# EAGLE design SparkFun GPS RTK Surveyor - Single End (EAGLE 9.6.2)

## Sheet 1 of 2
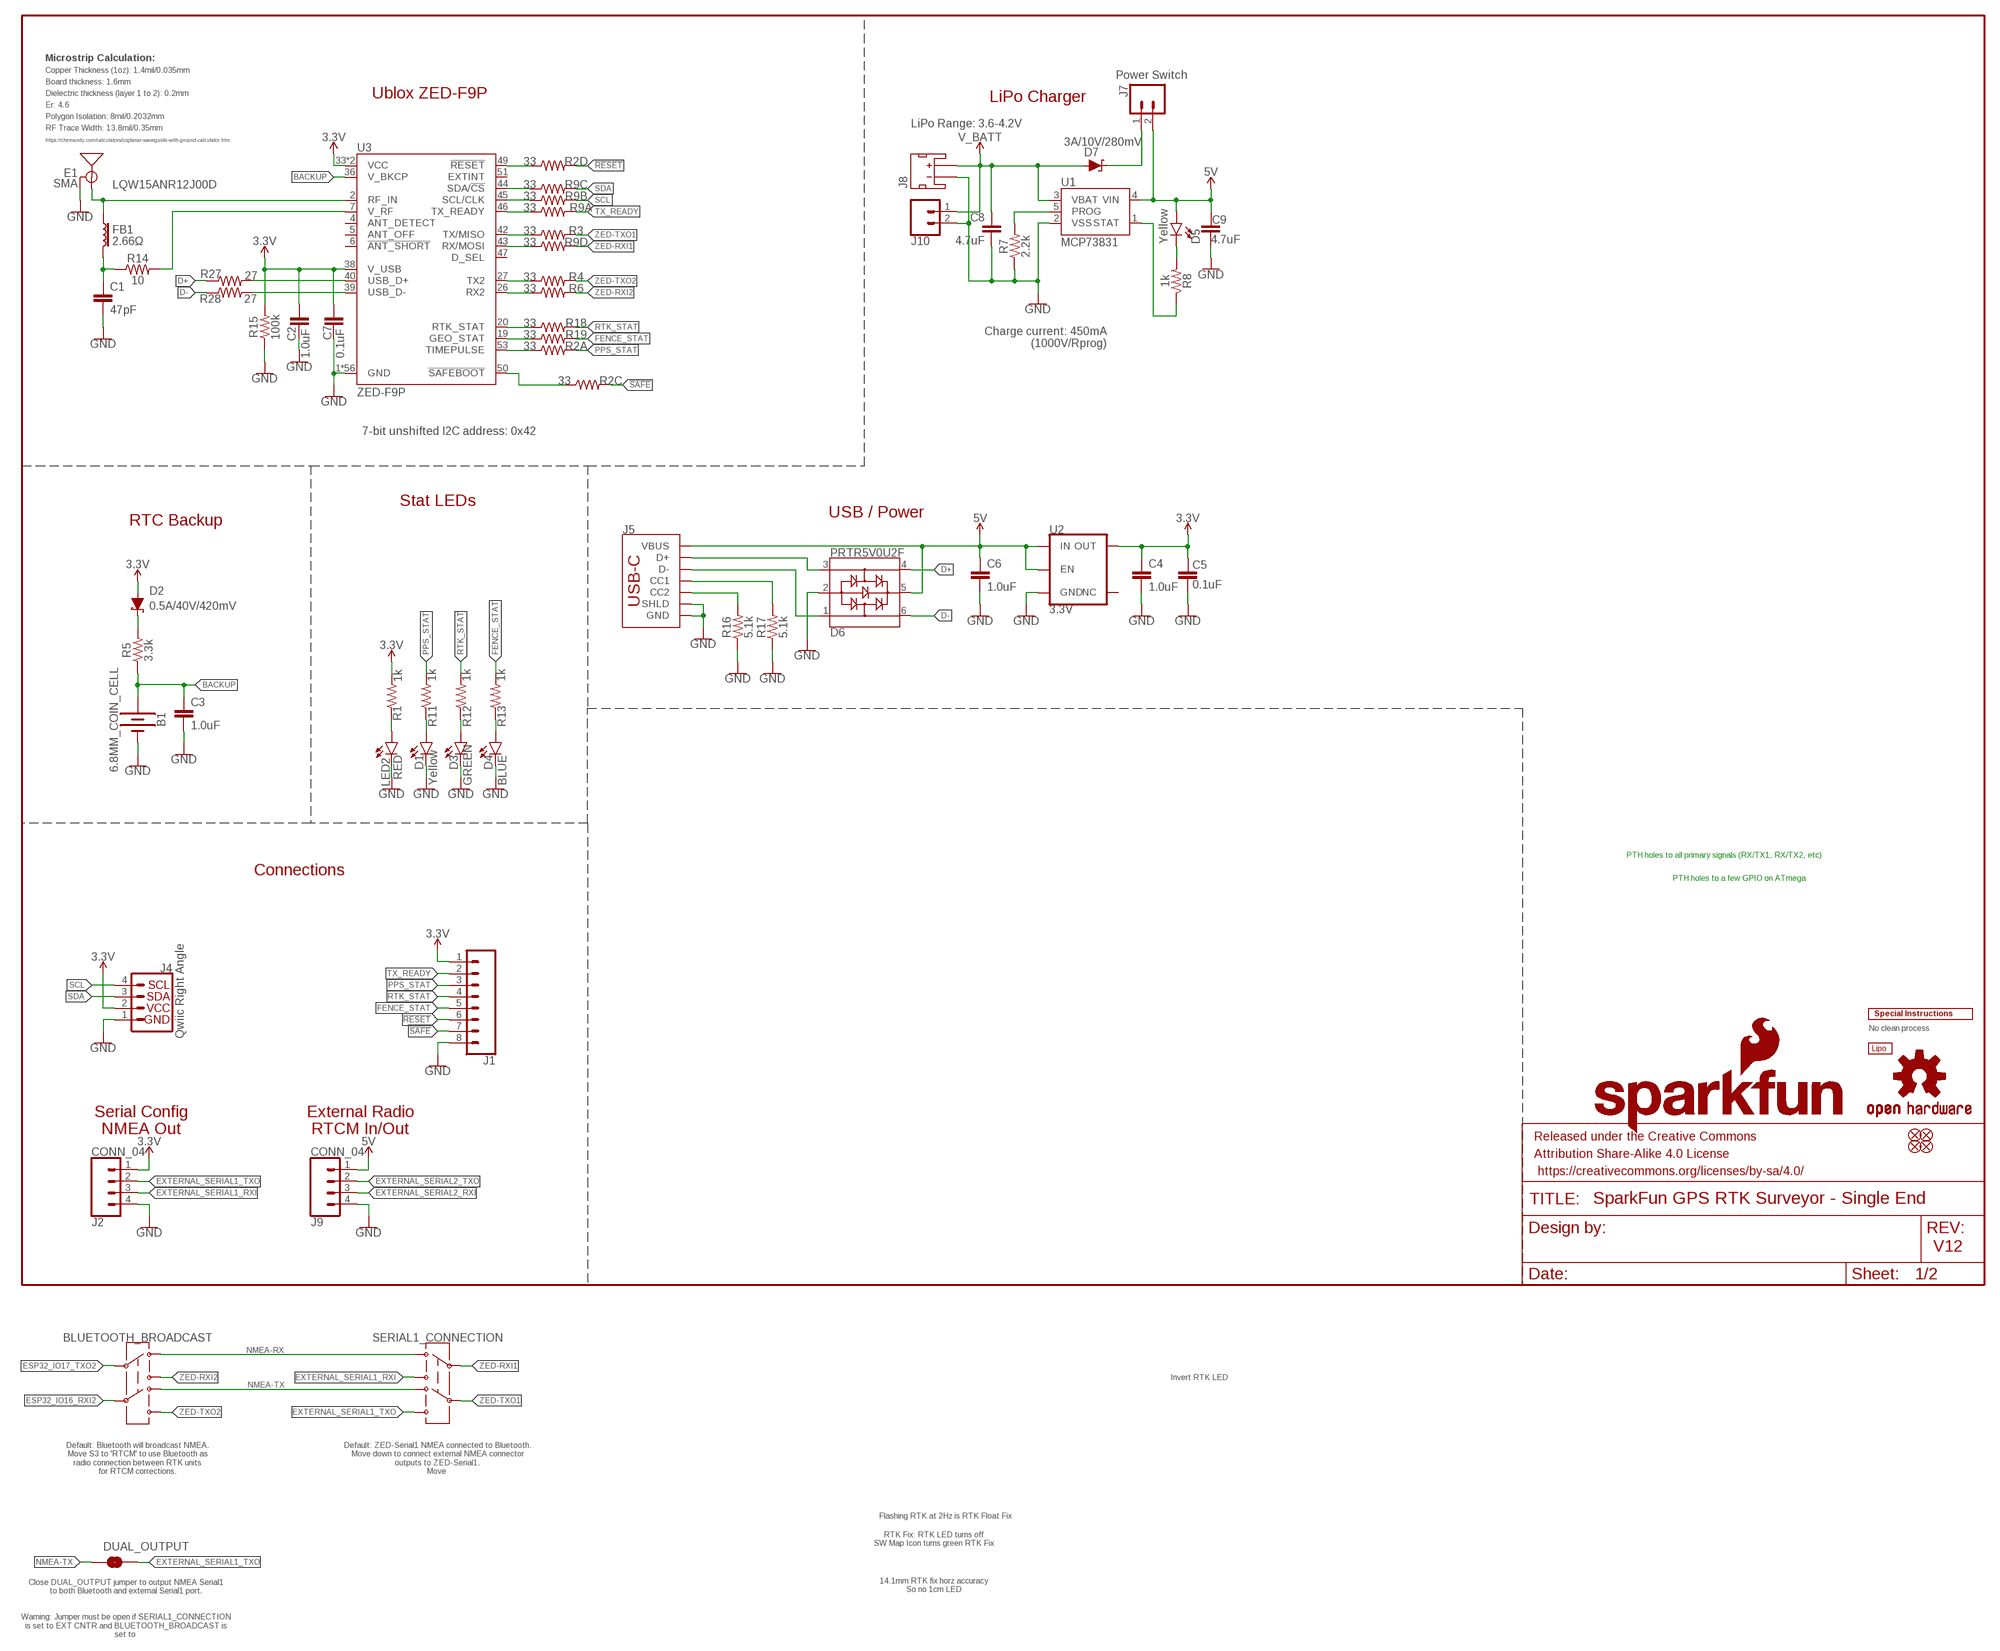
[diagram p0: schematic, sheet 1, part 1 of 2]
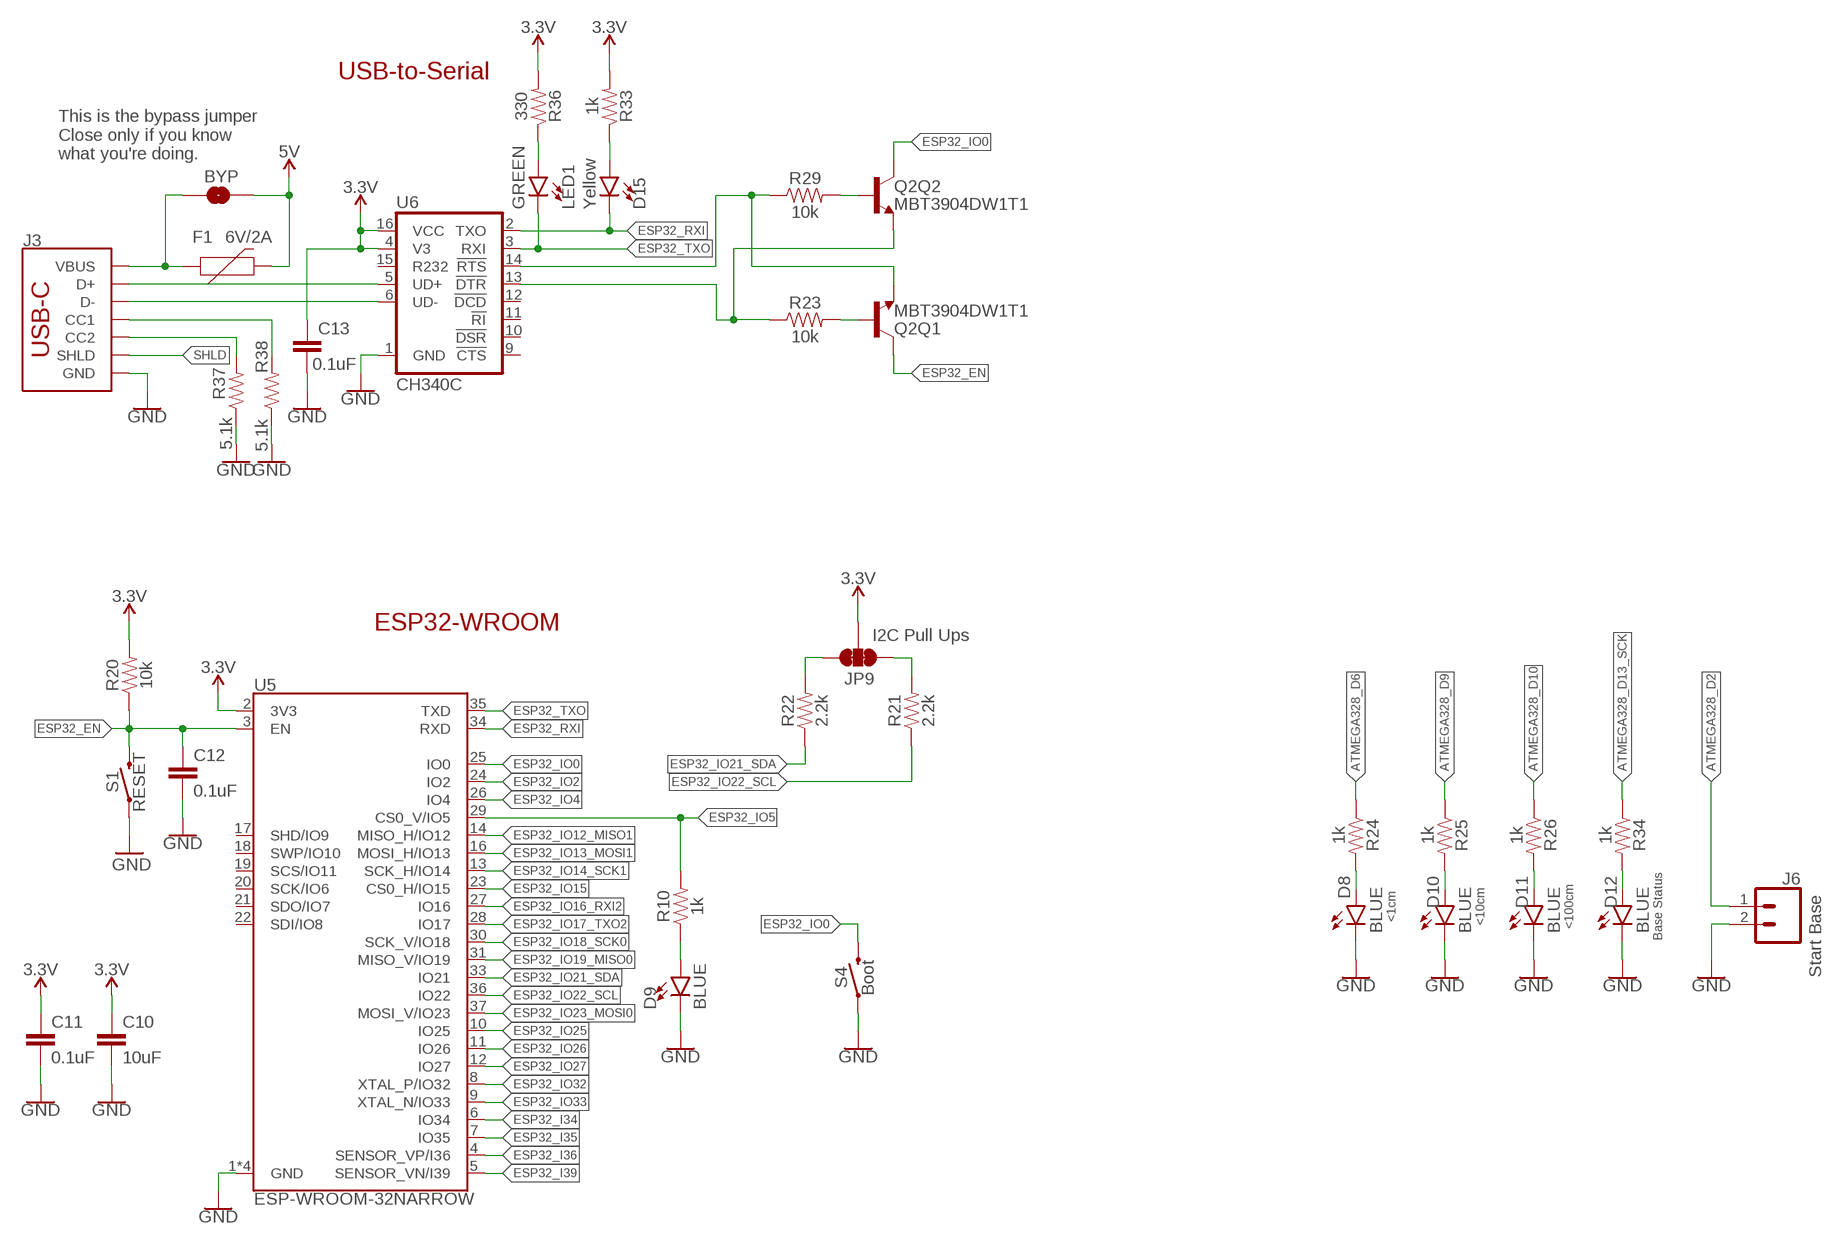
[diagram p1: schematic, sheet 1, part 2 of 2]

### Parts
B1  6.8MM_COIN_CELL  ML414H_IV01E_BATTERY  [ML414H_IV01E]
BLUETOOTH_BROADCAST  SWITCH-DPDT-SMD-AYZ0202  [SWITCH_DPDT_SMD_AYZ0202]
BT1  LIPO-OUTLINE1100  [LIPO-1000]
BYP  JUMPER-SMT_2_NO_SILK  [SMT-JUMPER_2_NO_SILK]
C1  47pF  47PF-0402-25V-5%-X7R  [0402]
C2  1.0uF  1.0UF-0603-16V-10%-X7R  [0603]
C3  1.0uF  1.0UF-0603-16V-10%-X7R  [0603]
C4  1.0uF  1.0UF-0603-16V-10%-X7R  [0603]
C5  0.1uF  0.1UF-0603-25V-5%  [0603]
C6  1.0uF  1.0UF-0603-16V-10%-X7R  [0603]
C7  0.1uF  0.1UF-0603-25V-5%  [0603]
C8  4.7uF  4.7UF-0603-35V-(20%)  [0603]
C9  4.7uF  4.7UF-0603-35V-(20%)  [0603]
C10  10uF  10UF-0603-6.3V-20%  [0603]
C11  0.1uF  0.1UF-0603-25V-(+80/-20%)  [0603]
C12  0.1uF  0.1UF-0603-25V-(+80/-20%)  [0603]
C13  0.1uF  0.1UF-0603-25V-(+80/-20%)  [0603]
D1  Yellow  LED-YELLOW0603  [LED-0603]
D2  0.5A/40V/420mV  DIODE-SCHOTTKY-PMEG4005EJ  [SOD-323]
D3  GREEN  LED-GREEN0603  [LED-0603]
D4  BLUE  LED-BLUE0603  [LED-0603]
D5  Yellow  LED-YELLOW0603  [LED-0603]
D6  PRTR5V0U2F  [SOT886]
D7  3A/10V/280mV  DIODE-SCHOTTKY-BAT60A  [SOD-323]
D8  BLUE  LED-BLUE0603  [LED-0603]
D9  BLUE  LED-BLUE0603  [LED-0603]
D10  BLUE  LED-BLUE0603  [LED-0603]
D11  BLUE  LED-BLUE0603  [LED-0603]
D12  BLUE  LED-BLUE0603  [LED-0603]
D15  Yellow  LED-YELLOW0603  [LED-0603]
DUAL_OUTPUT  JUMPER-SMT_2_NO_SILK  [SMT-JUMPER_2_NO_SILK]
E1  SMA  ANTENNA-GROUNDEDEDGE_SMA_SMD  [SMA-EDGE-SMD]
F1  6V/2A  PPTC_6V2A  [1210]
FB1  2.66Ω  FERRITE_BEAD-0402-2.66OHM-1GHZ  [0402-TIGHT]
FRAME2  FRAME-LEDGER  [CREATIVE_COMMONS]
J1  CONN_08NO_SILK_DNP  [1X08_NO_SILK]
J2  CONN_04  [JST-4-SMD-1.25MM-LOCKING]
J3  USB-C  USB_C_2-LAYER_PADS  [USB-C-16P-2LAYER-PADS]
J4  Qwiic Right Angle  I2C_STANDARDQWIIC  [JST04_1MM_RA]
J5  USB_C_2-LAYER_PADS  [USB-C-16P-2LAYER-PADS]
J6  Start Base  CONN_02-JST-2MM-SMT  [JST-2-SMD]
J7  Power Switch  CONN_02-JST-2MM-SMT  [JST-2-SMD]
J8  JST_2MM_MALE  [JST-2-SMD]
J9  CONN_04  [JST-4-SMD-1.25MM-LOCKING]
J10  CONN_021X02_NO_SILK  [1X02_NO_SILK]
JP9  JUMPER-SMT_3_2-NC_TRACE_SILK  [SMT-JUMPER_3_2-NC_TRACE_SILK]
JP21  FIDUCIALUFIDUCIAL  [MICRO-FIDUCIAL]
JP61  FIDUCIALUFIDUCIAL  [MICRO-FIDUCIAL]
JP71  FIDUCIALUFIDUCIAL  [MICRO-FIDUCIAL]
JP81  FIDUCIALUFIDUCIAL  [MICRO-FIDUCIAL]
LED1  GREEN  LED-GREEN0603  [LED-0603]
LED2  RED  LED-RED0603  [LED-0603]
LOGO1  OSHW-LOGOMINI  [OSHW-LOGO-MINI]
LOGO2  SFE_LOGO_NAME_FLAME.1_INCH  [SFE_LOGO_NAME_FLAME_.1]
Q2  MBT3904DW1T1  TRANS_NPN_DUAL-MBT3904DW1T1  [SC70-6]
R1  1k  1KOHM-0603-1/10W-1%  [0603]
R2  33  33OHM_RA-1206-1/16W-5%  [1206_RA]
R3  33  33OHM-0603-1/10W-1%  [0603]
R4  33  33OHM-0603-1/10W-1%  [0603]
R5  3.3k  3.3KOHM-0603-1/10W-1%  [0603]
R6  33  33OHM-0603-1/10W-1%  [0603]
R7  2.2k  2.2KOHM-0603-1/10W-1%  [0603]
R8  1k  1KOHM-0603-1/10W-1%  [0603]
R9  33  33OHM_RA-1206-1/16W-5%  [1206_RA]
R10  1k  1KOHM-0603-1/10W-1%  [0603]
R11  1k  1KOHM-0603-1/10W-1%  [0603]
R12  1k  1KOHM-0603-1/10W-1%  [0603]
R13  1k  1KOHM-0603-1/10W-1%  [0603]
R14  10  10OHM-0603-1/10W-1%  [0603]
R15  100k  100KOHM-0603-1/10W-1%  [0603]
R16  5.1k  5.1KOHM5.1KOHM-0603-1/10W-1%  [0603]
R17  5.1k  5.1KOHM5.1KOHM-0603-1/10W-1%  [0603]
R18  33  33OHM-0603-1/10W-1%  [0603]
R19  33  33OHM-0603-1/10W-1%  [0603]
R20  10k  10KOHM-0603-1/10W-1%  [0603]
R21  2.2k  2.2KOHM-0603-1/10W-1%  [0603]
R22  2.2k  2.2KOHM-0603-1/10W-1%  [0603]
R23  10k  10KOHM-0603-1/10W-1%  [0603]
R24  1k  1KOHM-0603-1/10W-1%  [0603]
R25  1k  1KOHM-0603-1/10W-1%  [0603]
R26  1k  1KOHM-0603-1/10W-1%  [0603]
R27  27  27OHM-0603-1/10W-1%  [0603]
R28  27  27OHM-0603-1/10W-1%  [0603]
R29  10k  10KOHM-0603-1/10W-1%  [0603]
R33  1k  1KOHM-0603-1/10W-1%  [0603]
R34  1k  1KOHM-0603-1/10W-1%  [0603]
R36  330  330OHM-0603-1/10W-1%  [0603]
R37  5.1k  5.1KOHM5.1KOHM-0603-1/10W-1%  [0603]
R38  5.1k  5.1KOHM5.1KOHM-0603-1/10W-1%  [0603]
S1  RESET  MOMENTARY-SWITCH-SPST-SMD-6.0X3.5MM  [TACTILE_SWITCH_SMD_6.0X3.5MM]
S4  Boot  MOMENTARY-SWITCH-SPST-SMD-6.0X3.5MM  [TACTILE_SWITCH_SMD_6.0X3.5MM]
SERIAL1_CONNECTION  SWITCH-DPDT-SMD-AYZ0202  [SWITCH_DPDT_SMD_AYZ0202]
U1  MCP73831  [SOT23-5]
U2  3.3V  V_REG_AP2112K-3.3V  [SOT23-5]
U3  ZED-F9P  [ZED-F9P]
U5  ESP-WROOM-32NARROW  [ESP-WROOM-32-NARROW]
U6  CH340C  [SO016]
U$2  SPECIAL_INSTRUCTIONS-ORDERING  [ORDERING_INSTRUCTIONS]

### Nets
3.3V: C2.1 C4.1 C5.2 C7.2 C10.1 C11.1 C13.1 D2.A J1.1 J2.1 J4.2 JP9.2 R1.2 R15.2 R20.2 R33.2 R36.2 U2.5(OUT) U3.33(VCC) U3.34(VCC) U3.38(V_USB) U5.2(3V3) U6.4(V3) U6.16(VCC)
5V: BYP.2 C6.1 C9.1 D5.A D6.5 F1.2 J5.VBUS1(VBUS) J5.VBUS2(VBUS) J7.2 J9.1 U1.4(VIN) U2.1(IN) U2.3(EN)
!RESET: J1.6 R2.P5
!SAFE: J1.7 R2.P6
ANT_VCC: C1.1 FB1.2 R14.1
ATMEGA328_D2: J6.1
ATMEGA328_D6: R24.1
ATMEGA328_D9: R25.1
ATMEGA328_D10: R26.1
ATMEGA328_D13_SCK: R34.1
BACKUP: B1.+ C3.1 R5.1 U3.36(V_BKCP)
CC1: J5.A5(CC1) R17.2
CC2: J5.B5(CC2) R16.2
CC3: J3.B5(CC2) R37.2
CC4: J3.A5(CC1) R38.2
CHG_LED: R8.1 U1.1(STAT)
D+: D6.4 R27.1
D+1: J3.A6(D+) J3.B6(D+) U6.5(UD+)
D-: D6.6 R28.1
D-1: J3.A7(D-) J3.B7(D-) U6.6(UD-)
ESP32_!DTR: Q2.1(Q2:E) R23.1 U6.13(!DTR)
ESP32_!RTS: Q2.4(Q1:E) R29.1 U6.14(!RTS)
ESP32_EN: C12.1 Q2.3(Q1:C) R20.1 S1.2 U5.3(EN)
ESP32_I34: U5.6(IO34)
ESP32_I35: U5.7(IO35)
ESP32_I36: U5.4(SENSOR_VP/I36)
ESP32_I39: U5.5(SENSOR_VN/I39)
ESP32_IO0: Q2.6(Q2:C) S4.2 U5.25(IO0)
ESP32_IO2: U5.24(IO2)
ESP32_IO4: U5.26(IO4)
ESP32_IO5: R10.2 U5.29(CS0_V/IO5)
ESP32_IO12_MISO1: U5.14(MISO_H/IO12)
ESP32_IO13_MOSI1: U5.16(MOSI_H/IO13)
ESP32_IO14_SCK1: U5.13(SCK_H/IO14)
ESP32_IO15: U5.23(CS0_H/IO15)
ESP32_IO16_RXI2: BLUETOOTH_BROADCAST.5 U5.27(IO16)
ESP32_IO17_TXO2: BLUETOOTH_BROADCAST.2 U5.28(IO17)
ESP32_IO18_SCK0: U5.30(SCK_V/IO18)
ESP32_IO19_MISO0: U5.31(MISO_V/IO19)
ESP32_IO21_SDA: R22.1 U5.33(IO21)
ESP32_IO22_SCL: R21.1 U5.36(IO22)
ESP32_IO23_MOSI0: U5.37(MOSI_V/IO23)
ESP32_IO25: U5.10(IO25)
ESP32_IO26: U5.11(IO26)
ESP32_IO27: U5.12(IO27)
ESP32_IO32: U5.8(XTAL_P/IO32)
ESP32_IO33: U5.9(XTAL_N/IO33)
ESP32_RXI: D15.C U5.34(RXD) U6.2(TXO)
ESP32_TXO: LED1.C U5.35(TXD) U6.3(RXI)
EXTERNAL_SERIAL1_RXI: J2.3 SERIAL1_CONNECTION.3
EXTERNAL_SERIAL1_TXO: DUAL_OUTPUT.2 J2.2 SERIAL1_CONNECTION.6
EXTERNAL_SERIAL2_RXI: J9.3
EXTERNAL_SERIAL2_TXO: J9.2
FENCE_STAT: J1.5 R13.2 R19.2
GND: B1.- C1.2 C2.2 C3.2 C4.2 C5.1 C6.2 C7.1 C8.2 C9.2 C10.2 C11.2 C12.2 C13.2 D1.C D3.C D4.C D6.2 D8.C D9.C D10.C D11.C D12.C E1.GND@0(GND) E1.GND@1(GND) J1.8 J2.4 J3.GND J3.GND2(GND) J4.1 J5.GND J5.GND2(GND) J5.SHLD1(SHLD) J5.SHLD2(SHLD) J5.SHLD3(SHLD) J5.SHLD4(SHLD) J6.2 J8.1(-) J9.4 J10.2 LED2.C R7.1 R15.1 R16.1 R17.1 R37.1 R38.1 S1.1 S4.1 U1.2(VSS) U2.2(GND) U3.1(GND) U3.3(GND) U3.12(GND) U3.14(GND) U3.32(GND) U3.37(GND) U3.41(GND) U3.48(GND) U3.55(GND) U3.56(GND) U3.57(GND) U3.58(GND) U3.59(GND) U3.60(GND) U3.61(GND) U3.62(GND) U3.63(GND) U3.64(GND) U3.65(GND) U3.66(GND) U3.67(GND) U3.68(GND) U3.69(GND) U3.70(GND) U3.71(GND) U3.72(GND) U3.73(GND) U3.74(GND) U3.75(GND) U3.76(GND) U3.77(GND) U3.78(GND) U3.79(GND) U3.80(GND) U3.81(GND) U3.82(GND) U3.83(GND) U3.84(GND) U3.85(GND) U3.86(GND) U3.87(GND) U3.88(GND) U3.89(GND) U3.90(GND) U3.91(GND) U3.92(GND) U3.93(GND) U3.94(GND) U3.95(GND) U3.96(GND) U3.97(GND) U3.98(GND) U3.99(GND) U3.100(GND) U3.101(GND) U3.102(GND) U5.1(GND) U5.15(GND) U5.38(GND) U5.GND U6.1(GND)
GPS_ANT1 [RF]: E1.SIG(SIGNAL) FB1.1 U3.2(RF_IN)
N$1: D3.A R12.1
N$2: D1.A R11.1
N$5: R7.2 U1.5(PROG)
N$6: D2.C R5.2
N$7: D4.A R13.1
N$8: D5.C R8.2
N$10: LED2.A R1.1
N$11: R27.2 U3.40(USB_D+)
N$12: R28.2 U3.39(USB_D-)
N$13: R14.2 U3.7(V_RF)
N$14: R6.1 U3.26(RX2)
N$16: R2.P4 U3.49(!RESET!)
N$18: R2.P3 U3.50(!SAFEBOOT!)
N$19: R18.1 U3.20(RTK_STAT)
N$20: R19.1 U3.19(GEO_STAT)
N$22: R9.P1 U3.46(TX_READY)
N$23: D9.A R10.1
N$24: Q2.5(Q1:B) R23.2
N$25: Q2.2(Q2:B) R29.2
N$26: D8.A R24.2
N$27: D10.A R25.2
N$28: LED1.A R36.1
N$29: D11.A R26.2
N$30: D12.A R34.2
N$31: D15.A R33.1
N$32: BYP.1 F1.1 J3.VBUS1(VBUS) J3.VBUS2(VBUS)
NMEA-RX: BLUETOOTH_BROADCAST.1 SERIAL1_CONNECTION.1
NMEA-TX: BLUETOOTH_BROADCAST.4 DUAL_OUTPUT.1 SERIAL1_CONNECTION.4
PPS [RF]: R2.P1 U3.53(TIMEPULSE)
PPS_STAT: J1.3 R2.P8 R11.2
RTK_STAT: J1.4 R12.2 R18.2
RXLV: R9.P4 U3.43(RX/MOSI)
SCL: J4.4 R9.P7
SCL_LV: R9.P2 U3.45(SCL/CLK)
SCL_PU1: JP9.1 R21.2
SDA: J4.3 R9.P6
SDA_LV: R9.P3 U3.44(SDA/!CS!)
SDA_PU1: JP9.3 R22.2
SHLD: J3.SHLD1(SHLD) J3.SHLD2(SHLD) J3.SHLD3(SHLD) J3.SHLD4(SHLD)
TX2_P: R4.1 U3.27(TX2)
TX_READY: J1.2 R9.P8
TXLV: R3.1 U3.42(TX/MISO)
UNP_D+: D6.3 J5.A6(D+) J5.B6(D+)
UNP_D-: D6.1 J5.A7(D-) J5.B7(D-)
V_BATT: C8.1 D7.A J8.2(+) J10.1 U1.3(VBAT)
VBATT_SWTICHED: D7.C J7.1
ZED-RXI1: R9.P5 SERIAL1_CONNECTION.2
ZED-RXI2: BLUETOOTH_BROADCAST.3 R6.2
ZED-TXO1: R3.2 SERIAL1_CONNECTION.5
ZED-TXO2: BLUETOOTH_BROADCAST.6 R4.2
Unconnected: J8.NC1(PAD1) J8.NC2(PAD2) R2.P2 R2.P7 U2.4(NC) U3.4(ANT_DETECT) U3.5(ANT_OFF) U3.6(!ANT_SHORT!) U3.47(D_SEL) U3.51(EXTINT) U5.17(SHD/IO9) U5.18(SWP/IO10) U5.19(SCS/IO11) U5.20(SCK/IO6) U5.21(SDO/IO7) U5.22(SDI/IO8) U6.9(!CTS) U6.10(!DSR) U6.11(!RI) U6.12(!DCD) U6.15(R232)

### Notes on the sheet
- Microstrip Calculation:
- Copper Thickness (1oz): 1.4mil/0.035mm
- Board thickness: 1.6mm
- Ublox ZED-F9P
- Dielectric thickness (layer 1 to 2): 0.2mm | LiPo Charger
- Er: 4.6
- Polygon Isolation: 8mil/0.2032mm | LiPo Range: 3.6-4.2V | USB-to-Serial
- RF Trace Width: 13.8mil/0.35mm
- https://chemandy.com/calculators/coplanar-waveguide-with-ground-calculator.htm
- This is the bypass jumper
  Close only if you know 
  what you're doing.
- LQW15ANR12J00D
- Charge current: 450mA
  (1000V/Rprog)
- 7-bit unshifted I2C address: 0x42
- ESP32-WROOM
- I2C Pull Ups
- Stat LEDs
- USB / Power
- RTC Backup
- <1cm | <10cm | <100cm | Base Status
- PTH holes to all primary signals (RX/TX1, RX/TX2, etc)
- Connections
- PTH holes to a few GPIO on ATmega
- No clean process
- Serial Config
  NMEA Out
- External Radio
  RTCM In/Out
- V12
- Invert RTK LED
- Default: Bluetooth will broadcast NMEA.
  Move S3 to 'RTCM' to use Bluetooth as
  radio connection between RTK units
  for RTCM corrections.
- Default: ZED-Serial1 NMEA connected to Bluetooth.
  Move down to connect external NMEA connector
  outputs to ZED-Serial1.
  Move
- Flashing RTK at 2Hz is RTK Float Fix
- RTK Fix: RTK LED turns off
  SW Map Icon turns green RTK Fix
- 14.1mm RTK fix horz accuracy
  So no 1cm LED
- Close DUAL_OUTPUT jumper to output NMEA Serial1
  to both Bluetooth and external Serial1 port.
  
  
  Warning: Jumper must be open if SERIAL1_CONNECTION
  is set to EXT CNTR and BLUETOOTH_BROADCAST is
  set to

## Sheet 2 of 2

## Library data of the parts
B1 = SparkFun-Batteries:ML414H_IV01E_BATTERY: SEIKO ML414H-IV01E Reflowable Lithium Battery ML414H is a rechargeable, coin type battery with features such as Pb-free reflowable (Peak temperature: 260 C) and high temperature heat resistance. Battery Characteristics: 3.1V max voltage Voff is 2V 1mAH 3k series resistor with battery 72 hour charge time from 2.0-3.1V 2.3-2.8V initial charge; PROD_ID: BATT-14267
BLUETOOTH_BROADCAST SERIAL1_CONNECTION = SparkFun-Switches:SWITCH-DPDT: Double-Pole, Double-Throw (DPDT) Switch Double-pole, double-throw switches. Variant Overview PTH-GPI-152-3013 Used on SparkFun Geiger Counter <https://www.sparkfun.com/products/11345> SMD-AY0202 Surface Mount DPDT Switch <https://www.sparkfun.com/products/597> (COM-00597) Used on e.g. LilyPad Arduino USB - ATmega32U4 Board <https://www.sparkfun.com/products/12049>; PROD_ID: SWCH-08179; SF_SKU: COM-00597
BT1 = SparkFun-Batteries:LIPO-OUTLINE: LiPo Battery Outlines Outlines for common LiPo batteries sold by SparkFun. (Note: no terminals or connection points, just the dimensions.) SparkFun Products Polymer Lithium Ion Battery - 110mAh <https://www.sparkfun.com/products/13853> (PRT-13853) Polymer Lithium Ion Battery - 1000mAh <https://www.sparkfun.com/products/13813> (PRT-13813) Polymer Lithium Ion Battery - 2000mAh <https://www.sparkfun.com/products/8483> (PRT-08483); PROD_ID: BATT-13243; SF_SKU: PRT-13813
BYP DUAL_OUTPUT = SparkFun-Jumpers:JUMPER-SMT_2_NO: Normally open jumper This jumper has two pads in close proximity to each other. Apply solder to close the connection. Round pads are easier to solder for beginners, but are a lot larger. SparkFun Product that uses the round pads: SparkFun EL Sequencer <https://www.sparkfun.com/products/12781>
C1 = SparkFun-Capacitors:47PF: 47pF ceramic capacitors A capacitor is a passive two-terminal electrical component used to store electrical energy temporarily in an electric field.; PROD_ID: CAP-15063
C2-C4 C6 = SparkFun-Capacitors:1.0UF: 1µF ceramic capacitors A capacitor is a passive two-terminal electrical component used to store electrical energy temporarily in an electric field.; PROD_ID: CAP-13930
C5 C7 = SparkFun-Capacitors:0.1UF: 0.1µF ceramic capacitors A capacitor is a passive two-terminal electrical component used to store electrical energy temporarily in an electric field.; PROD_ID: CAP-08604
C8 C9 = SparkFun-Capacitors:4.7UF: 4.7µF ceramic capacitors A capacitor is a passive two-terminal electrical component used to store electrical energy temporarily in an electric field.; PROD_ID: CAP-14106
C10 = SparkFun-Capacitors:10UF: 10.0µF ceramic capacitors A capacitor is a passive two-terminal electrical component used to store electrical energy temporarily in an electric field.; PROD_ID: CAP-11015
C11-C13 = SparkFun-Capacitors:0.1UF: 0.1µF ceramic capacitors A capacitor is a passive two-terminal electrical component used to store electrical energy temporarily in an electric field.; PROD_ID: CAP-00810
D1 D5 D15 = SparkFun-LED:LED-YELLOW: Yellow SMD LED Used in manufacturing several products at SparkFun. Packages: 0603 - SMD 0603 package[Product Link] <http://www.kingbrightusa.com/product.asp?catalog_name=LED&product_id=APT1608SYCK> 0603 -SMART - SMART SMD 0603 package (more efficient/more expensive) [Product Link] <http://www.osram-os.com/osram_os/en/products/product-catalog/led-light-emitting-diodes/smartled-0603/ly-l29k/index.jsp> LilyPad - SMD1206 package[Product Datasheet] <https://www.sparkfun.com/datasheets/DevTools/LilyPad/Q150YUS4.pdf> SparkFun Products: Blynk Board <https://www.sparkfun.com/products/13794> IOIO-OTG <https://www.sparkfun.com/products/13613> XBee Explorer Serial <https://www.sparkfun.com/products/13225>; PROD_ID: DIO-09003
D2 = SparkFun-DiscreteSemi:DIODE-SCHOTTKY: Schottky diode A Schottky diode is a semiconductor diode which has a low forward voltage drop and a very fast switching action.; PROD_ID: DIO-10955
D3 LED1 = SparkFun-LED:LED-GREEN: Green SMD LED Used in manufacturing of various products at SparkFun Packages: 0603 - SMD 0603 package [Product Link] <http://www.futureelectronics.com/en/technologies/semiconductors/optoelectronics/leds/Pages/9894312-LTST-C190GKT.aspx?CrossPart=HSMG-C190&IM=0> LilyPad 1206 - SMD1206 LilyPad package [Product Link] <http://www.futureelectronics.com/en/Technologies/Product.aspx?ProductID=IN150NGHARVATEKCORPORATION2049943&IM=0> 1206 - SMD1206 package [Product Link] <http://www.futureelectronics.com/en/technologies/semiconductors/optoelectronics/leds/Pages/8315665-LTST-C150KGKT.aspx?IM=0> 1206 Bottom Mount -SMD 1206 Bottom Mount [Product Link] <http://www.digikey.com/product-detail/en/lite-on-inc/LTST-C230KGKT/160-1456-1-ND/386854> SparkFun Products: Pro Mini 328 -5V <https://www.sparkfun.com/products/821> RedBoard <https://www.sparkfun.com/products/12757> MP3 Trigger <https://www.sparkfun.com/products/13720> Makey Makey <https://www.sparkfun.com/products/11076>; PROD_ID: DIO-00821
D4 D8-D12 = SparkFun-LED:LED-BLUE: Blue SMD LED Used in manufacturing of various products at SparkFun Packages: 0603 - SMD 0603 package [Product Link] <http://www.digikey.com/product-detail/en/SMLE12BC7TT86/511-1589-2-ND/1641808> 1206 - SMD1206 package [Product Link] <http://www.digikey.com/product-detail/en/lite-on-inc/LTST-C150TBKT/160-1643-1-ND/573584> SparkFun Products: ESP8266 Thing-Dev Board <https://www.sparkfun.com/products/13711> RedBoard <https://www.sparkfun.com/products/12757>; PROD_ID: DIO-08575
D6 = SparkFun-IC-Power:PRTR5V0U2: A small ESD protection device. Most commonly used on USB D+/D- signals to protect large, expensive, or especially sensitive USB enabled devices.; PROD_ID: DIO-14084
D7 = SparkFun-DiscreteSemi:DIODE-SCHOTTKY: Schottky diode A Schottky diode is a semiconductor diode which has a low forward voltage drop and a very fast switching action.; PROD_ID: DIO-14072
E1 = SparkFun-RF:ANTENNA-GROUNDED: Antenna w/ Ground Connection 2.4GHz antennae with signal and ground terminals. TRACE_ANTENNA_2.4GHZ_15.2MM - Meander Trace antenna 15.2 x 5.7mm footprint Based on layout from TI app note AN043 <http://www.ti.com/lit/an/swra117d/swra117d.pdf>. TRACE_ANTENNA_2.4GHZ_25.7MM - Inverted F trace antenna 25.7 x 7.5 mm footprint. Based on layout from TI design note DN0007 <http://www.ti.com/lit/an/swru120b/swru120b.pdf>.; PROD_ID: CONN-15100
F1 = SparkFun-Fuses:PPTC: Resettable Fuse PPTC Resettable Fuse. Really a sort of resistor with a polymeric positive temperature coefficient whose resistance increases dramatically with an increase in temperature. When heated by the power passing through the resistance rises causing the current to be limited, protecting the circuit. This is achieved by the transition of the polymer from a crystalline to an amorphous state where the conductive carbon separates breaking the conductive pathways found in the cool crystalline structure. When a PPTC cools back down it resumes conducting letting the circuit turn back on. SparkFun Products: SparkFun RedBoard - Programmed with Arduino <https://www.sparkfun.com/products/12757> Pro Micro - 5V/16MHz <https://www.sparkfun.com/products/12640> Arduino Pro 328 - 5V/16MHz <https://www.sparkfun.com/products/10915> MP3 Trigger <https://www.sparkfun.com/products/13720>; PROD_ID: RES-14313
FB1 = SparkFun-Coils:FERRITE_BEAD: Ferrite Bead (blocks, cores, rings, chokes, etc.) Inductor with layers of ferrite used to suppress high frequencies. Often used to isolate high frequency noise. SparkFun Products: IOIO-OTG - V2.2 <https://www.sparkfun.com/products/13613> SparkFun SAMD21 Mini Breakout <https://www.sparkfun.com/products/13664> SparkFun 6 Degrees of Freedom Breakout - LSM6DS3 <https://www.sparkfun.com/products/13339> SparkFun SAMD21 Dev Breakout <https://www.sparkfun.com/products/13672>; PROD_ID: NDUC-15072
FRAME2 = SparkFun-Aesthetics:FRAME-LEDGER: Schematic Frame - Ledger Standard 11x14 US Ledger frame
J1 = SparkFun-Connectors:CONN_08: Multi connection point. Often used as Generic Header-pin footprint for 0.1 inch spaced/style header connections On any of the 0.1 inch spaced packages, you can populate with these: Break Away Headers - Straight <https://www.sparkfun.com/products/116> (PRT-00116) Break Away Male Headers - Right Angle <https://www.sparkfun.com/products/553> (PRT-00553) Female Headers <https://www.sparkfun.com/products/115> (PRT-00115) Break Away Headers - Machine Pin <https://www.sparkfun.com/products/117> (PRT-00117) Break Away Female Headers - Swiss Machine Pin <https://www.sparkfun.com/products/743> (PRT-00743) Arduino Stackable Header - 8 Pin <https://www.sparkfun.com/products/9279> (PRT-09279) For SCREWTERMINALS and SPRING TERMINALS visit here: Screw Terimnals on SparkFun.com <https://www.sparkfun.com/search/results?term=Screw+Terminals> (5mm/3.5mm/2.54mm spacing) This device is also useful as a general connection point to wire up your design to another part of your project. Our various solder wires solder well into these plated through hole pads. Hook-Up Wire - Assortment (Stranded, 22 AWG) <https://www.sparkfun.com/products/11375> (PRT-11375) Hook-Up Wire - Assortment (Solid Core, 22 AWG) <https://www.sparkfun.com/products/11367> (PRT-11367) View the entire wire category on our website here <https://www.sparkfun.com/categories/141> Special notes: Molex polarized connector foot print use with SKU : PRT-08231 with associated crimp pins and housings. 1MM SMD Version SKU: PRT-10208 NOTES ON THE VARIANTS LOCK and LOCK_LONGPADS... This footprint was designed to help hold the alignment of a through-hole component (i.e. 6-pin header) while soldering it into place. You may notice that each hole has been shifted either up or down by 0.005 of an inch from it's more standard position (which is a perfectly straight line). This slight alteration caused the pins (the squares in the middle) to touch the edges of the holes. Because they are alternating, it causes a "brace" to hold the component in place. 0.005 has proven to be the perfect amount of "off-center" position when using our standard breakaway headers. Although looks a little odd when you look at the bare footprint, once you have a header in there, the alteration is very hard to notice. Also,if you push a header all the way into place, it is covered up entirely on the bottom side.
J2 J9 = SparkFun GPS RTK Surveyor:CONN_04
J3 J5 = SparkFun-Connectors:USB_C: USB Type C 16Pin Connector Super Speed pins not available on the 16-pin purely SMD connector so this part is best for USB 2.0 implementations. D1 and D2 are tied together enabling D+/- no matter which way the cable is plugged into the connector. The two channel configuration pins (CC1/2) are exposed. These are normally connected to ground via 5.1k resistors but can be reconfigured for high current/high power applications.; PROD_ID: CONN-14122
J4 = SparkFun-Connectors:I2C_STANDARD: SparkFun I2C Standard Pinout Header SparkFun has standardized on a pinout for all I2C based sensor breakouts. This pinout allows I2C boards to be plugged directly into the headers on Arduino Uno compatible boards, and to be daisy chained easily. Example SparkFun Products: SparkFun Atmospheric Sensor Breakout - BME280 <https://www.sparkfun.com/products/13676> SparkFun Altitude/Pressure Sensor Breakout - MPL3115A2 <https://www.sparkfun.com/products/11084> SparkFun TOF Range Finder Sensor - VL6180 <https://www.sparkfun.com/products/12785>; PROD_ID: CONN-13694
J6 J7 = SparkFun-Connectors:CONN_02: Multi connection point. Often used as Generic Header-pin footprint for 0.1 inch spaced/style header connections On any of the 0.1 inch spaced packages, you can populate with these: Break Away Headers - Straight <https://www.sparkfun.com/products/116> (PRT-00116) Break Away Male Headers - Right Angle <https://www.sparkfun.com/products/553> (PRT-00553) Female Headers <https://www.sparkfun.com/products/115> (PRT-00115) Break Away Headers - Machine Pin <https://www.sparkfun.com/products/117> (PRT-00117) Break Away Female Headers - Swiss Machine Pin <https://www.sparkfun.com/products/743> (PRT-00743) For SCREWTERMINALS and SPRING TERMINALS visit here: Screw Terimnals on SparkFun.com <https://www.sparkfun.com/search/results?term=Screw+Terminals> (5mm/3.5mm/2.54mm spacing) This device is also useful as a general connection point to wire up your design to another part of your project. Our various solder wires solder well into these plated through hole pads. Hook-Up Wire - Assortment (Stranded, 22 AWG) <https://www.sparkfun.com/products/11375> (PRT-11375) Hook-Up Wire - Assortment (Solid Core, 22 AWG) <https://www.sparkfun.com/products/11367> (PRT-11367) View the entire wire category on our website here <https://www.sparkfun.com/categories/141> Special notes: Molex polarized connector foot print use with: PRT-08233 with associated crimp pins and housings. 2.54_SCREWTERM for use with PRT-10571. 3.5mm Screw Terminal footprints for PRT-08084 5mm Screw Terminal footprints for use with PRT-08432; PROD_ID: CONN-11443
J8 = SparkFun-Connectors:JST_2MM_MALE: JST 2MM MALE RA CONNECTOR Two pin, compact surface mount connector. Commonly used as a battery input connection point. We really like the solid locking feeling and high current rating on these small connectors. We use these all the time as battery connectors. Mates to single-cell LiPo batteries. Here is the connector we sell at SparkFun: JST Right Angle Connector - White <https://www.sparkfun.com/products/8612> (PRT-08612) Datasheet <http://www.sparkfun.com/datasheets/Prototyping/Connectors/JST-Horizontal.pdf> It was used on these SparkFun products: SparkFun MOSFET Power Controller <https://www.sparkfun.com/products/11214> (PRT-11214) SparkFun Battery Babysitter - LiPo Battery Manager <https://www.sparkfun.com/products/13777> (PRT-13777) And many, many others that required a lipo battery connection.; PROD_ID: CONN-11443; SF_ID: PRT-08612
J10 = SparkFun-Connectors:CONN_02: Multi connection point. Often used as Generic Header-pin footprint for 0.1 inch spaced/style header connections On any of the 0.1 inch spaced packages, you can populate with these: Break Away Headers - Straight <https://www.sparkfun.com/products/116> (PRT-00116) Break Away Male Headers - Right Angle <https://www.sparkfun.com/products/553> (PRT-00553) Female Headers <https://www.sparkfun.com/products/115> (PRT-00115) Break Away Headers - Machine Pin <https://www.sparkfun.com/products/117> (PRT-00117) Break Away Female Headers - Swiss Machine Pin <https://www.sparkfun.com/products/743> (PRT-00743) For SCREWTERMINALS and SPRING TERMINALS visit here: Screw Terimnals on SparkFun.com <https://www.sparkfun.com/search/results?term=Screw+Terminals> (5mm/3.5mm/2.54mm spacing) This device is also useful as a general connection point to wire up your design to another part of your project. Our various solder wires solder well into these plated through hole pads. Hook-Up Wire - Assortment (Stranded, 22 AWG) <https://www.sparkfun.com/products/11375> (PRT-11375) Hook-Up Wire - Assortment (Solid Core, 22 AWG) <https://www.sparkfun.com/products/11367> (PRT-11367) View the entire wire category on our website here <https://www.sparkfun.com/categories/141> Special notes: Molex polarized connector foot print use with: PRT-08233 with associated crimp pins and housings. 2.54_SCREWTERM for use with PRT-10571. 3.5mm Screw Terminal footprints for PRT-08084 5mm Screw Terminal footprints for use with PRT-08432
JP9 = SparkFun-Jumpers:JUMPER-SMT_3_2-NC_TRACE: Normally closed trace jumper (2 of 2 connections) This jumper has a trace between all three pads so they are normally closed (NC). Use a razor knife to open the connection(s). For best results follow the IPC guidelines for cutting traces: Cutout at least 0.063 mm (0.005 in). Remove all loose material to clean up the cut area. Seal the cut with an approved epoxy. Reapply solder to reclose the connection(s).
JP21 JP61 JP71 JP81 = SparkFun:FIDUCIAL: Fiducial Alignment Points Various fiducial points for machine vision alignment.
LED2 = SparkFun-LED:LED-RED: Red SMD LED Used in manufacturing of most products at SparkFun Packages: 0603 - SMD 0603 package [Product Link] <http://docs.avagotech.com/docs/AV02-0551EN> 0603 SMART - SMD 0603 SMART package ( more efficient and expensive)[Product Link] <http://www.osram-os.com/Graphics/XPic2/00077099_0.pdf> 1206 - SMD1206 package [Product Link] <https://www.sparkfun.com/datasheets/DevTools/LilyPad/Q150OVS4.pdff> SparkFun Products: Pro Mini 328 -5V <https://www.sparkfun.com/products/821> RedBoard <https://www.sparkfun.com/products/12757> IOIO-OTG <https://www.sparkfun.com/products/13613>; PROD_ID: DIO-00819
LOGO1 = SparkFun-Aesthetics:OSHW-LOGO: Open-Source Hardware (OSHW) Logo This logo indicates the piece of hardware it is found on incorporates a OSHW license and/or adheres to the definition of open source hardware found here: http://freedomdefined.org/OSHW
LOGO2 = SparkFun-Aesthetics:SFE_LOGO_NAME_FLAME: SparkFun Font Logo w/ Flame This is the SparkFun full logo. The logo on the schematic will always be the same size; the package variant is the height of the flame part of the logo. Default layer for the logo on the board is tSilk.
Q2 = SparkFun-DiscreteSemi:TRANS_NPN_DUAL: Dual NPN Transistors in Single Package The MBT3904W1 puts two general purpose 3904 NPN transistors in a single package. Datasheet <http://www.onsemi.com/pub_link/Collateral/MBT3904DW1T1-D.PDF> SparkFun Products: SparkFun ESP32 Thing <https://www.sparkfun.com/products/13907>; PROD_ID: TRANS-13337
R1 R8 R10-R13 R24-R26 R33 R34 = SparkFun-Resistors:1KOHM: 1kΩ resistor A resistor is a passive two-terminal electrical component that implements electrical resistance as a circuit element. Resistors act to reduce current flow, and, at the same time, act to lower voltage levels within circuits. - Wikipedia; PROD_ID: RES-07856
R2 R9 = SparkFun-Resistors:33OHM_RA: EXB-38V330JV Four Resistory Array - AEC-Q200 Certified; PROD_ID: RES-15081
R3 R4 R6 R18 R19 = SparkFun-Resistors:33OHM: 33Ω resistor A resistor is a passive two-terminal electrical component that implements electrical resistance as a circuit element. Resistors act to reduce current flow, and, at the same time, act to lower voltage levels within circuits. - Wikipedia; PROD_ID: RES-08270
R5 = SparkFun-Resistors:3.3KOHM: 3.3kΩ resistor A resistor is a passive two-terminal electrical component that implements electrical resistance as a circuit element. Resistors act to reduce current flow, and, at the same time, act to lower voltage levels within circuits. - Wikipedia; PROD_ID: RES-07851
R7 R21 R22 = SparkFun-Resistors:2.2KOHM: 2.2kΩ resistor A resistor is a passive two-terminal electrical component that implements electrical resistance as a circuit element. Resistors act to reduce current flow, and, at the same time, act to lower voltage levels within circuits. - Wikipedia; PROD_ID: RES-08272
R14 = SparkFun-Resistors:10OHM: 10Ω resistor A resistor is a passive two-terminal electrical component that implements electrical resistance as a circuit element. Resistors act to reduce current flow, and, at the same time, act to lower voltage levels within circuits. - Wikipedia; PROD_ID: RES-12581
R15 = SparkFun-Resistors:100KOHM: 100kΩ resistor A resistor is a passive two-terminal electrical component that implements electrical resistance as a circuit element. Resistors act to reduce current flow, and, at the same time, act to lower voltage levels within circuits. - Wikipedia; PROD_ID: RES-07828
R16 R17 R37 R38 = SparkFun-Resistors:5.1KOHM; PROD_ID: RES-12083
R20 R23 R29 = SparkFun-Resistors:10KOHM: 10kΩ resistor A resistor is a passive two-terminal electrical component that implements electrical resistance as a circuit element. Resistors act to reduce current flow, and, at the same time, act to lower voltage levels within circuits. - Wikipedia; PROD_ID: RES-00824
R27 R28 = SparkFun-Resistors:27OHM: 27Ω resistor A resistor is a passive two-terminal electrical component that implements electrical resistance as a circuit element. Resistors act to reduce current flow, and, at the same time, act to lower voltage levels within circuits. - Wikipedia; PROD_ID: RES-09334
R36 = SparkFun-Resistors:330OHM: 330Ω resistor A resistor is a passive two-terminal electrical component that implements electrical resistance as a circuit element. Resistors act to reduce current flow, and, at the same time, act to lower voltage levels within circuits. - Wikipedia; PROD_ID: RES-00818
S1 S4 = SparkFun-Switches:MOMENTARY-SWITCH-SPST: Momentary Switch (Pushbutton) - SPST Normally-open (NO) SPST momentary switches (buttons, pushbuttons). Variants PTH-12MM - 12mm square, through-hole Momentary Pushbutton Switch - 12mm Square <https://www.sparkfun.com/products/9190> (COM-09190) PTH-6.0MM, PTH-6.0MM-KIT - 6.0mm square, through-hole Mini Pushbutton Switch <https://www.sparkfun.com/products/97> (COM-00097) KIT package intended for soldering kit's - only one side of pads' copper is exposed. PTH-RIGHT-ANGLE-KIT - Right-angle, through-hole Right Angle Tactile Button <https://www.sparkfun.com/products/10791> - Used on SparkFun BigTime Watch Kit <https://www.sparkfun.com/products/11734> SMD-12MM - 12mm square, surface-mount Tactile Button - SMD (12mm) <https://www.sparkfun.com/products/12993> (COM-12993) Used on SparkFun PicoBoard <https://www.sparkfun.com/products/11888> SMD-4.5MM - 4.5mm Square Trackball Switch Used on SparkFun Blackberry Trackballer Breakout <https://www.sparkfun.com/products/13169> SMD-4.6MMX2.8MM - 4.60mm x 2.80mm, surface mount Used on SparkFun SAMD21 Mini Breakout <https://www.sparkfun.com/products/13664> SMD-5.2MM, SMD-5.2-REDUNDANT - 5.2mm square, surface-mount Mini Pushbutton Switch - SMD <https://www.sparkfun.com/products/8720> (COM-08720) Used on Arduino Pro Mini <https://www.sparkfun.com/products/11114> REDUNDANT package connects both switch circuits together SMD-6.0X3.5MM - 6.0 x 3.5mm, surface mount Momentary Reset Switch SMD <https://www.sparkfun.com/products/8229> (COM-08229) SMD-6.2MM-TALL - 6.2mm square, surface mount Tactile Button - SMD (6mm) <https://www.sparkfun.com/products/12992> Used on SparkFun Digital Sandbox <https://www.sparkfun.com/products/12651> SMD-RIGHT-ANGLE - Right-angle, surface mount Used on SparkFun Block for Intel® Edison - Arduino <https://www.sparkfun.com/products/13036>; PROD_ID: SWCH-14278; SF_SKU: COM-08229
U1 = SparkFun-IC-Power:MCP73831: MCP73831T Li-Ion, Li-Pol Controller Miniature single cell, fully integrated Li-Ion, Li-polymer charge management controller Datasheet <http://ww1.microchip.com/downloads/en/DeviceDoc/20001984g.pdf> SparkFun Products: SparkFun ESP32 Thing <https://www.sparkfun.com/products/13907> SparkFun 9DoF Razor IMU M0 <https://www.sparkfun.com/products/14001>; PROD_ID: IC-09995
U2 = SparkFun-IC-Power:V_REG_AP2112: AP2112 - 600mA CMOS LDO Regulator w/ Enable The AP2112 is CMOS process low dropout linear regulator with enable function, the regulator delivers a guaranteed 600mA (min.) continuous load current. Features Output Voltage Accuracy: ±1.5% Output Current: 600mA (Min.) Foldback Short Current Protection: 50mA Enable Function to Turn ON/OFF VOUT Low Dropout Voltage (3.3V): 250mV (Typ.) @IOUT=600mA Excellent Load Regulation: 0.2%/A (Typ.) Excellent Line Regulation: 0.02%/V (Typ.) Low Quiescent Current: 55μA (Typ.) Low Standby Current: 0.01μA (Typ.) Low Output Noise: 50μVRMS PSRR: 100Hz -65dB, 1kHz -65dB OTSD Protection Stable with 1.0μF Flexible Cap: Ceramic, Tantalum and Aluminum Electrolytic Operation Temperature Range: -40°C to 85°C ESD: MM 400V, HBM 4000V; PROD_ID: VREG-12457
U3 = ZED-F9P:ZED-F9P
U5 = SparkFun-RF:ESP-WROOM-32; PROD_ID: IC-13849
U6 = SparkFun-IC-Comms:CH340C; PROD_ID: IC-14038
U$2 = SparkFun-Aesthetics:SPECIAL_INSTRUCTIONS: Special Ordering/Production Instructions Alert Symbol for special PCB ordering instructions or unique production process warnings. Ordering Instructions Production Instructions Types of information that should be added to box: Copper weight Soldermask color Silk color PCB thickness Number of layers PCB Standard: 1.6mm FR4 1 oz copper immersion silver plating red soldermask white silkscreen Types of information that should be added to box: Special wash requirements Depaneling instructions Humidification Glue curing Default text settings: 0.07 inch 9% ratio 50% line distance

## Net classes
0 default: width 0 mm, drill 0 mm
1 power: width 0.178 mm
2 3.3V: width 0.508 mm
3 RF: width 0.35 mm, clearance 0.203 mm

## Board
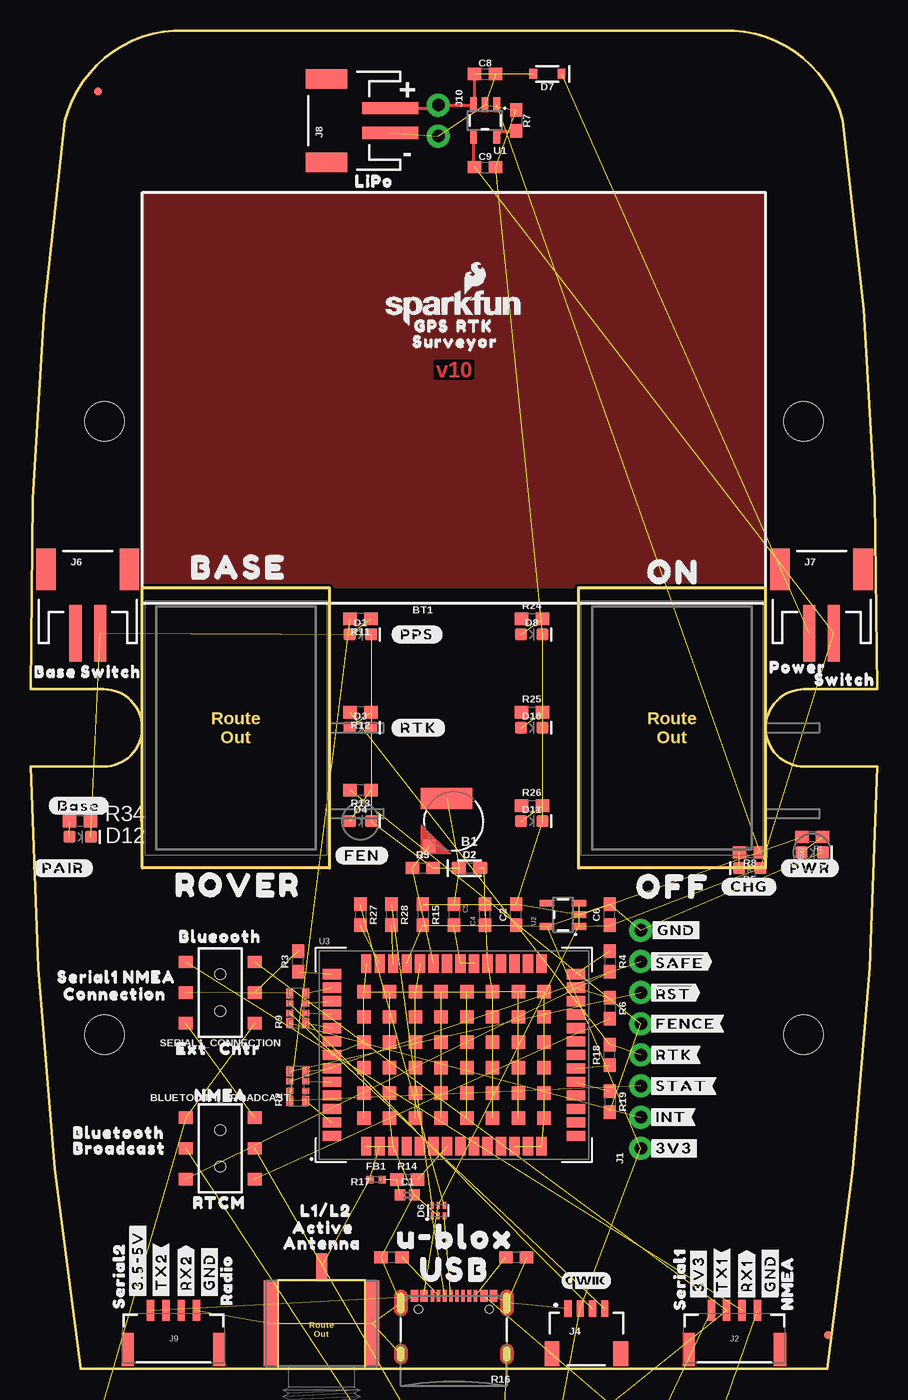
[diagram p2: board, top side]
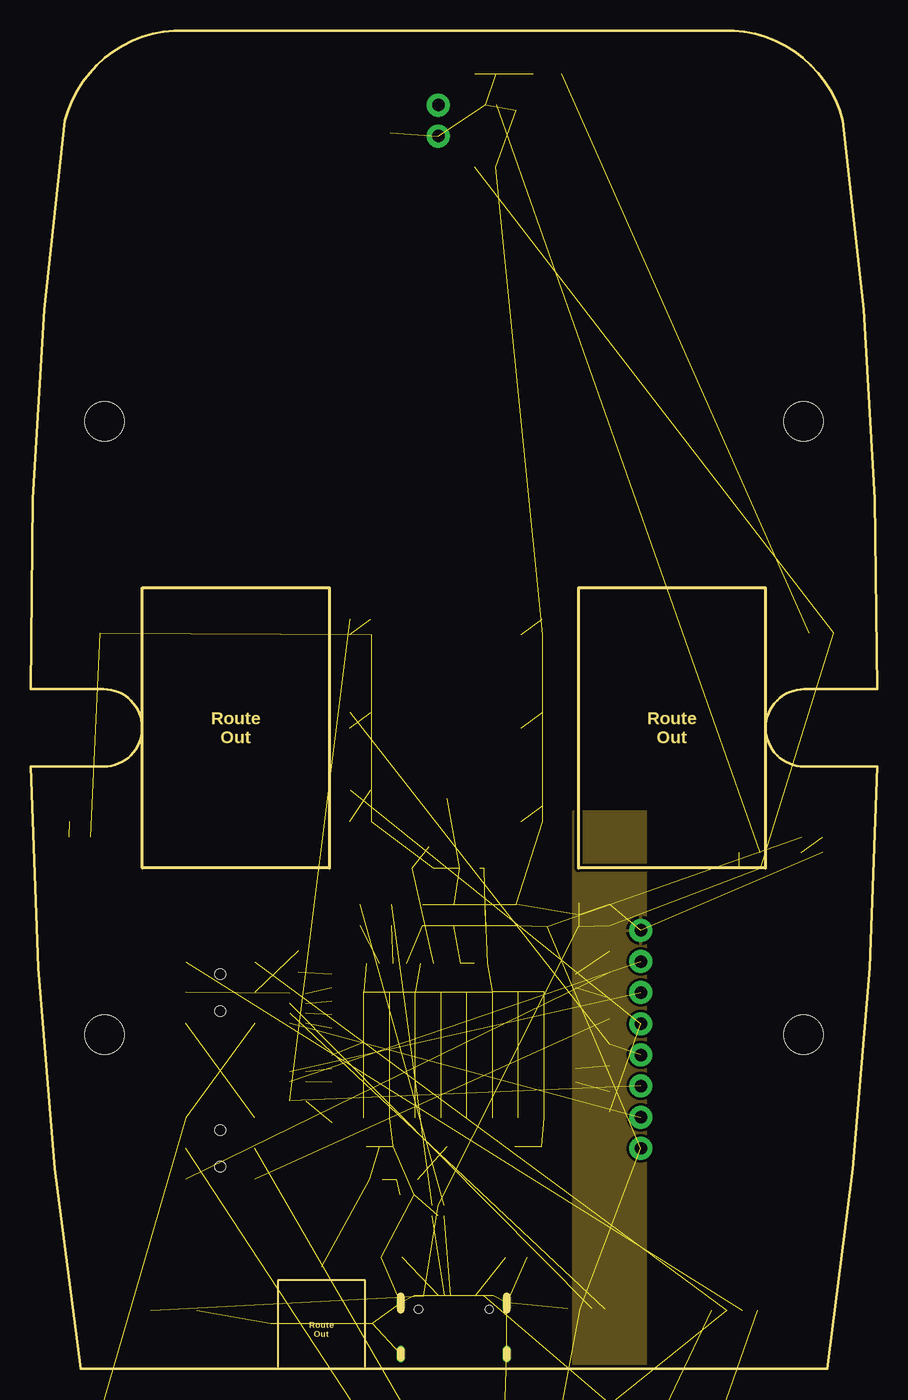
[diagram p3: board, inner layer Route2]
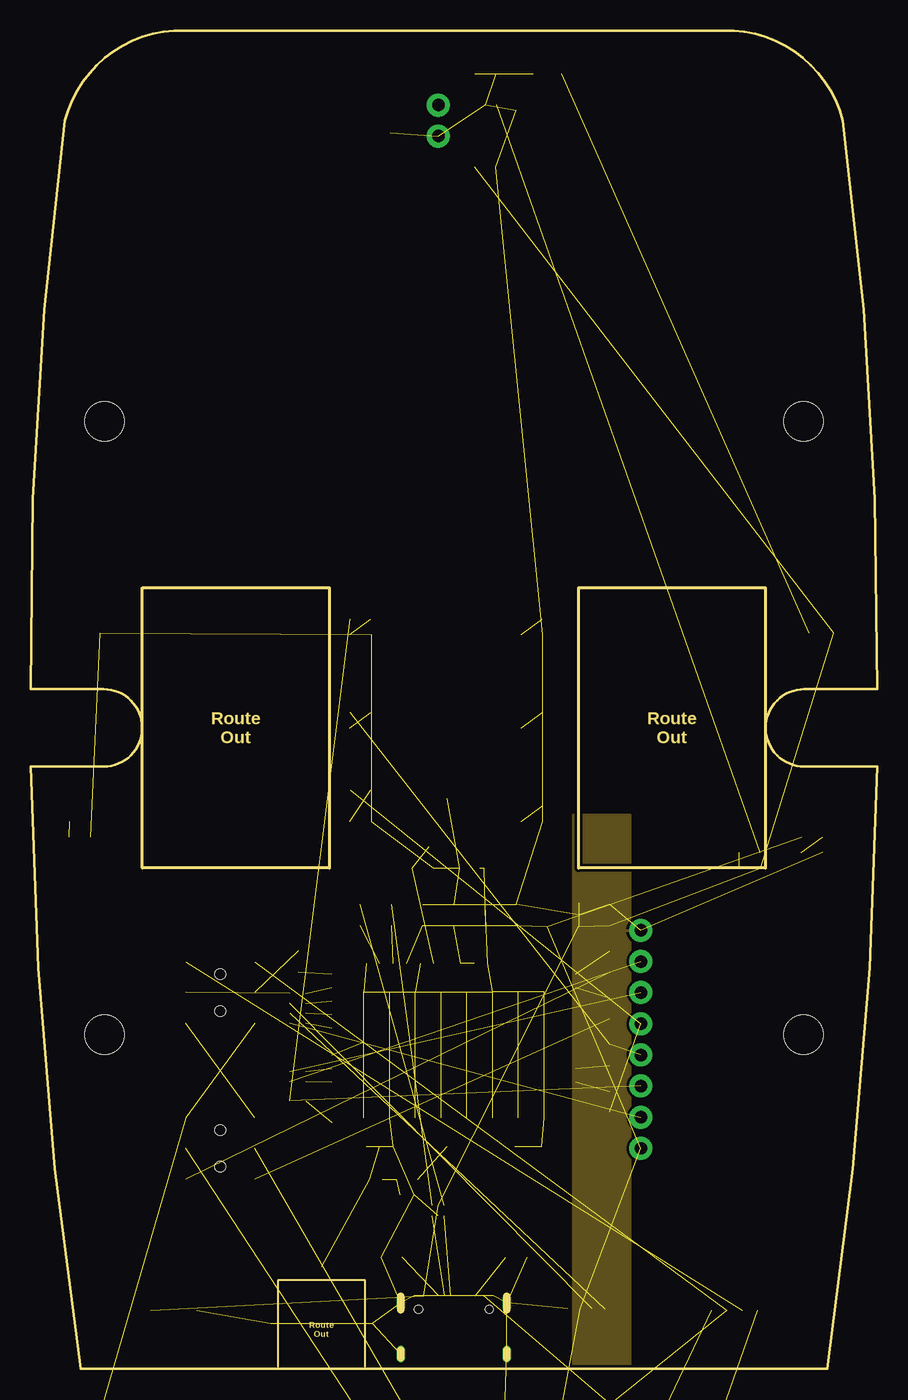
[diagram p4: board, inner layer Route15]
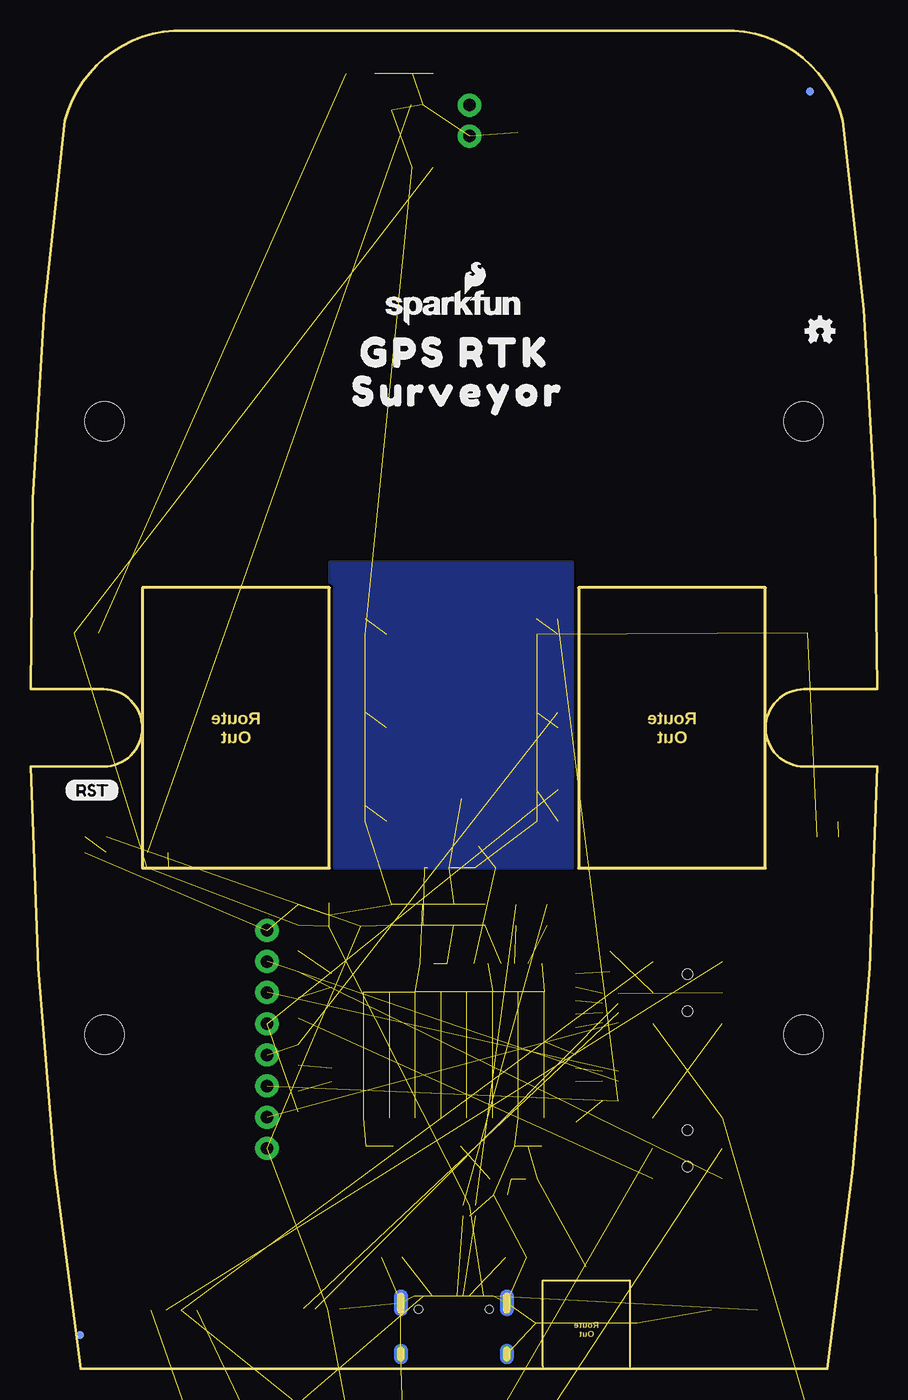
[diagram p5: board, bottom side, seen from below]

Size 69.02 x 109.14 mm. Coordinates in mm from the lower left corner, seen from the top.
Outline: 9.11,63.7 24.35,63.7 24.35,40.84 9.11,40.84 9.11,63.7
Outline: 44.67,63.7 59.91,63.7 59.91,40.84 44.67,40.84 44.67,63.7
Copper layers (1+2*15+16): Top 0.035mm / dielectric 1.5mm / Route2 0.035mm / dielectric 0.15mm / Route15 0.035mm / dielectric 0.2mm / Bottom 0.035mm
Design rules "SparkFun-4-layer-MicroMod *": minimum track width 4mil, minimum drill 0.2mm, track to track 4mil, track to pad 4mil, pad to pad 4mil, via to via 4mil, smd to smd 4mil, copper to edge 6mil, drill to drill 6mil, minimum pad ring 6mil, minimum via ring 6mil, stop-mask expansion 4mil, vias tented up to drill 25mil, thermal gap 10mil

### Footprints (pad centres in the part's own frame; a part is rotated, then mirrored left to right if it is on the bottom)
ML414H_IV01E = smd 1 x 1: + 2.022,2.032 | smd 4.2 x 1.7: - 0.6,-1.85
SWITCH_DPDT_SMD_AYZ0202 = smd 1 x 1.15: 1 -2.5,2.825; 2 0,2.825; 3 2.5,2.825; 4 -2.5,-2.825; 5 0,-2.825; 6 2.5,-2.825 | hole 0.85: 1.5,0; -1.5,0
SMT-JUMPER_2_NO_SILK = smd 0.635 x 1.27: 1 -0.406,0; 2 0.406,0
0402 = smd 0.85 x 0.9: 1 -0.58,0; 2 0.58,0
0603 = smd 1.1 x 1: 1 -0.85,0; 2 0.85,0
LED-0603 = smd 1 x 1: A -0.877,0; C 0.877,0
SOD-323 = smd 0.63 x 0.83: A 1.15,0; C -1.15,0
SOT886 = smd 0.61 x 0.25: 1 -0.405,0.5 | smd 0.56 x 0.25: 2 -0.43,0; 3 -0.43,-0.5; 4 0.43,-0.5; 5 0.43,0; 6 0.43,0.5
SMA-EDGE-SMD = smd 1.15 x 7: GND@0 -4.14,-3.5; GND@1 4.14,-3.5 | smd 0.9 x 2.2: SIG 0,-8.1
1210 = smd 1 x 2.8: 1 -1.5,0; 2 1.5,0
0402-TIGHT = smd 0.6 x 0.6: 1 -0.5,0; 2 0.5,0
1X08_NO_SILK = drill 1.016 pad 1.88: 1 0,0; 2 2.54,0; 3 5.08,0; 4 7.62,0; 5 10.16,0; 6 12.7,0; 7 15.24,0; 8 17.78,0
JST-4-SMD-1.25MM-LOCKING = smd 0.6 x 1.7: 1 -1.875,3.3; 2 -0.625,3.3; 3 0.625,3.3; 4 1.875,3.3 | smd 1 x 2.7: NC1 3.725,0.1; NC2 -3.725,0.1
USB-C-16P-2LAYER-PADS = smd 0.3 x 1: A5 -1.25,-0.34; A6 -0.25,-0.34; A7 0.25,-0.34; A8 1.25,-0.34; B5 1.75,-0.34; B6 0.75,-0.34; B7 -0.75,-0.34; B8 -1.75,-0.34 | smd 0.6 x 1: GND -3.225,-0.34; GND2 3.225,-0.34; VBUS1 -2.45,-0.34; VBUS2 2.45,-0.34 | drill 0.4 pad 0.6 long: SHLD1 -4.318,-0.915; SHLD2 4.318,-0.915; SHLD3 -4.318,-5.095; SHLD4 4.318,-5.095 | hole 0.65: -2.89,-1.445; 2.89,-1.445
JST04_1MM_RA = smd 0.6 x 1.35: 1 -1.5,0; 2 -0.5,0; 3 0.5,0; 4 1.5,0 | smd 1.2 x 2: NC1 2.8,-3.675; NC2 -2.8,-3.675
JST-2-SMD = smd 1 x 4.6: 1 -1,-3.7; 2 1,-3.7 | smd 1.6 x 3.4: NC1 -3.4,1.5; NC2 3.4,1.5
1X02_NO_SILK = drill 1.016 pad 1.88: 1 0,0; 2 2.54,0
SMT-JUMPER_3_2-NC_TRACE_SILK = smd 0.66 x 1.27: 1 -1.041,0; 2 0,0; 3 1.041,0
MICRO-FIDUCIAL = smd 0.635 x 0.635: 1 0,0
SC70-6 = smd 0.3 x 0.66: 1 -0.65,-0.92; 2 0,-0.92; 3 0.65,-0.92; 4 0.65,0.92; 5 0,0.92; 6 -0.65,0.92
1206_RA = smd 0.8 x 0.55: P1 -1.2,-0.62; P4 1.2,-0.62; P5 1.2,0.68; P8 -1.2,0.68 | smd 0.5 x 0.55: P2 -0.4,-0.62; P3 0.4,-0.62; P6 0.4,0.68; P7 -0.4,0.68
TACTILE_SWITCH_SMD_6.0X3.5MM = smd 2.3 x 1.6: 1 -3.15,0; 2 3.15,0
SOT23-5 = smd 0.55 x 1.2: 1 -0.95,-1.3; 2 0,-1.3; 3 0.95,-1.3; 4 0.95,1.3; 5 -0.95,1.3
ZED-F9P = smd 0.85 x 1.52: 1 -7.15,-7.45; 2 -6.05,-7.45; 3 -4.95,-7.45; 4 -3.85,-7.45; 5 -2.75,-7.45; 6 -1.65,-7.45; 7 -0.55,-7.45; 8 0.55,-7.45; 9 1.65,-7.45; 10 2.75,-7.45; 11 3.85,-7.45; 12 4.95,-7.45; 13 6.05,-7.45; 14 7.15,-7.45; 28 7.15,7.45; 29 6.05,7.45; 30 4.95,7.45; 31 3.85,7.45; 32 2.75,7.45; 33 1.65,7.45; 34 0.55,7.45; 35 -0.55,7.45; 36 -1.65,7.45; 37 -2.75,7.45; 38 -3.85,7.45; 39 -4.95,7.45; 40 -6.05,7.45; 41 -7.15,7.45 | smd 1.52 x 0.85: 15 9.95,-6.6; 16 9.95,-5.5; 17 9.95,-4.4; 18 9.95,-3.3; 19 9.95,-2.2; 20 9.95,-1.1; 21 9.95,0; 22 9.95,1.1; 23 9.95,2.2; 24 9.95,3.3; 25 9.95,4.4; 26 9.95,5.5; 27 9.95,6.6; 42 -9.95,6.6; 43 -9.95,5.5; 44 -9.95,4.4; 45 -9.95,3.3; 46 -9.95,2.2; 47 -9.95,1.1; 48 -9.95,0; 49 -9.95,-1.1; 50 -9.95,-2.2; 51 -9.95,-3.3; 52 -9.95,-4.4; 53 -9.95,-5.5; 54 -9.95,-6.6 | smd 1.1 x 1.1: 55 -1.05,-1.05; 56 -3.15,-1.05; 57 -5.25,-1.05; 58 -7.35,-1.05; 59 -1.05,-3.1; 60 -3.15,-3.1; 61 -5.25,-3.1; 62 -7.35,-3.1; 63 -1.05,-5.15; 64 -3.15,-5.15; 65 -5.25,-5.15; 66 -7.35,-5.15; 67 -1.05,5.15; 68 -3.15,5.15; 69 -5.25,5.15; 70 -7.35,5.15; 71 -1.05,3.1; 72 -3.15,3.1; 73 -5.25,3.1; 74 -7.35,3.1; 75 -1.05,1.05; 76 -3.15,1.05; 77 -5.25,1.05; 78 -7.35,1.05; 79 1.05,1.05; 80 3.15,1.05; 81 5.25,1.05; 82 7.35,1.05; 83 1.05,3.1; 84 3.15,3.1; 85 5.25,3.1; 86 7.35,3.1; 87 1.05,5.15; 88 3.15,5.15; 89 5.25,5.15; 90 7.35,5.15; 91 1.05,-5.15; 92 3.15,-5.15; 93 5.25,-5.15; 94 7.35,-5.15; 95 1.05,-3.1; 96 3.15,-3.1; 97 5.25,-3.1; 98 7.35,-3.1; 99 1.05,-1.05; 100 3.15,-1.05; 101 5.25,-1.05; 102 7.35,-1.05
ESP-WROOM-32-NARROW = smd 0.9 x 1.5: 1 6.43,8.238; 2 5.16,8.238; 3 3.89,8.238; 4 2.62,8.238; 5 1.35,8.238; 6 0.08,8.238; 7 -1.19,8.238; 8 -2.46,8.238; 9 -3.73,8.238; 10 -5,8.238; 11 -6.27,8.238; 12 -7.54,8.238; 13 -8.81,8.238; 14 -10.08,8.238; 25 -10.08,-8.238; 26 -8.81,-8.238; 27 -7.54,-8.238; 28 -6.27,-8.238; 29 -5,-8.238; 30 -3.73,-8.238; 31 -2.46,-8.238; 32 -1.19,-8.238; 33 0.08,-8.238; 34 1.35,-8.238; 35 2.62,-8.238; 36 3.89,-8.238; 37 5.16,-8.238; 38 6.43,-8.238 | smd 1.5 x 0.9: 15 -11.57,5.715; 16 -11.57,4.445; 17 -11.57,3.175; 18 -11.57,1.905; 19 -11.57,0.635; 20 -11.57,-0.635; 21 -11.57,-1.905; 22 -11.57,-3.175; 23 -11.57,-4.445; 24 -11.57,-5.715 | smd 6 x 6: GND -1.27,0
SO016 = smd 0.6 x 1.2: 1 -4.445,-2.8; 2 -3.175,-2.8; 3 -1.905,-2.8; 4 -0.635,-2.8; 5 0.635,-2.8; 6 1.905,-2.8; 7 3.175,-2.8; 8 4.445,-2.8; 9 4.445,2.8; 10 3.175,2.8; 11 1.905,2.8; 12 0.635,2.8; 13 -0.635,2.8; 14 -1.905,2.8; 15 -3.175,2.8; 16 -4.445,2.8
1553DBK-ENCLOSURE = hole 3.2: -25.006,28.499; 25.006,28.499; 25.006,-28.499; -25.006,-28.499

### Placement (x,y rotation side)
B1  34.51,44.66 180 top
BLUETOOTH_BROADCAST  15.46,17.98 270 top
BT1  59.91,62.43 90 top
BYP  89.12,-39.16 90 top  (outside the outline)
C1  30.7,14.17 0 top
C2  39.59,37.03 90 top
C3  31.97,40.84 0 top
C4  37.05,37.03 90 top
C5  34.51,37.03 270 top
C6  47.21,37.03 90 top
C7  35.78,40.84 0 top
C8  37.05,105.61 0 top
C9  37.05,98 0 top
C10  63.72,-31.55 90 top  (outside the outline)
C11  63.72,-27.74 90 top  (outside the outline)
C12  63.72,-23.93 90 top  (outside the outline)
C13  89.12,-31.55 90 top  (outside the outline)
D1  26.89,59.89 0 top
D2  35.78,40.84 0 top
D3  26.89,52.27 0 top
D4  26.89,44.66 0 top
D5  58.64,40.84 180 top
D6  33.24,12.9 90 top
D7  42.13,105.61 180 top
D8  40.86,59.89 0 top
D9  67.53,-32.82 90 top  (outside the outline)
D10  40.86,52.27 0 top
D11  40.86,44.66 0 top
D12  4.03,43.38 0 top
D15  98.01,-44.25 90 top  (outside the outline)
DUAL_OUTPUT  -6.13,-45.52 0 top  (outside the outline)
E1  23.71,0.2 180 top
F1  89.12,-48.05 90 top  (outside the outline)
FB1  28.16,15.44 0 top
FRAME2  95.47,6.55 0 top  (outside the outline)
J1  49.75,17.98 90 top
J2  57.37,1.47 0 top
J3  71.34,-45.52 90 top  (outside the outline)
J4  45.3,4.9 0 top
J5  34.51,6.3 0 top
J6  4.66,63.7 0 top
J7  64.48,63.7 0 top
J8  25.62,101.8 90 top
J9  11.65,1.47 0 top
J10  33.24,103.08 270 top
JP9  63.72,-41.7 90 top  (outside the outline)
JP21  64.99,2.74 0 top
JP61  5.48,104.16 0 top
JP71  64.99,2.74 0 bottom
JP81  5.48,104.16 0 bottom
LED1  98.01,-40.44 90 top  (outside the outline)
LED2  63.72,42.11 0 top
LOGO1  4.66,84.66 0 bottom
LOGO2  34.51,86.56 0 bottom
LOGO3  SFE_LOGO_NAME_FLAME.1_INCH  [SFE_LOGO_NAME_FLAME_.1]  34.51,86.56 0 top
Q2  81.5,-34.09 90 top  (outside the outline)
R1  63.72,43.38 180 top
R2  21.81,23.06 90 top
R3  21.81,33.23 90 top
R4  47.21,33.23 270 top
R5  31.97,40.84 0 top
R6  47.21,29.41 270 top
R7  39.59,101.8 270 top
R8  58.64,42.11 180 top
R9  21.81,29.41 90 top
R10  67.53,-48.05 90 top  (outside the outline)
R11  26.89,61.16 180 top
R12  26.89,53.55 180 top
R13  26.89,47.2 180 top
R14  30.7,15.44 0 top
R15  31.97,37.03 270 top
R16  39.59,9.09 180 top
R17  29.43,9.09 0 top
R18  47.21,25.6 90 top
R19  47.21,21.79 270 top
R20  67.53,-44.25 90 top  (outside the outline)
R21  67.53,-40.44 90 top  (outside the outline)
R22  67.53,-36.62 90 top  (outside the outline)
R23  94.2,-48.05 90 top  (outside the outline)
R24  40.86,61.16 0 top
R25  40.86,53.55 0 top
R26  40.86,45.92 0 top
R27  26.89,37.03 270 top
R28  29.43,37.03 270 top
R29  94.2,-44.25 90 top  (outside the outline)
R33  94.2,-40.44 90 top  (outside the outline)
R34  4.03,44.66 180 top
R36  94.2,-36.62 90 top  (outside the outline)
R37  94.2,-32.82 90 top  (outside the outline)
R38  98.01,-48.05 90 top  (outside the outline)
S1  58.64,-45.52 90 top  (outside the outline)
S4  58.64,-36.62 90 top  (outside the outline)
SERIAL1_CONNECTION  15.46,30.68 90 top
U1  37.05,101.8 180 top
U2  43.4,37.03 90 top
U3  34.51,25.6 0 top
U5  45.94,-37.9 90 top  (outside the outline)
U6  82.77,-44.25 90 top  (outside the outline)
U$1  [#GND#0]  50.38,35.77 0 top
U$2  76.42,81.48 0 top  (outside the outline)
U$3  [ROCKER_SWITCH]  16.73,52.27 270 top
U$4  [#BASE#0]  1.49,45.92 0 top
U$5  [GPS0]  30.57,85.04 0 top
U$6  [ANTENNA0]  19.9,10.24 0 top
U$7  [GPS_RTK0]  43.91,82.88 0 bottom
U$8  [#CHG#0]  56.35,39.32 0 top
U$9  [_SURVEYOR3]  45.43,79.71 0 bottom
U$10  [#RTK#1]  50.26,25.6 0 top
U$11  [#STAT#0]  50.26,23.06 0 top
U$12  [#RTK#0]  29.43,52.27 0 top
U$13  [LIGHT_PIPE_3MM]  63.72,42.11 0 top
U$14  [SURVEYOR1]  30.45,83.77 0 top
U$15  [#FEN#0]  24.86,41.86 0 top
U$16  [RTK1]  34,85.04 0 top
U$17  [##SAFE##5]  50.26,33.23 0 top
U$18  [ACTIVE0]  20.67,11.51 0 top
U$19  [L1#L21]  21.3,12.9 0 top
U$20  [#PAIR#0]  0.22,40.84 0 top
U$21  [LIGHT_PIPE_3MM]  26.89,44.66 0 top
U$22  [BASE2]  11.65,65.36 0 top
U$23  [#3#5#5V#0]  8.73,5.67 90 top
U$24  [#PPS#1]  29.43,59.89 0 top
U$25  [#PWR#2]  61.18,40.84 0 top
U$26  [1553DBK-ENCLOSURE]  34.51,52.27 90 top
U$27  [LIPO0]  25.75,96.85 0 top
U$28  [##RST##4]  50.26,30.68 0 top
U$29  [SERIAL10]  52.92,4.14 90 top
U$30  [QWIIC_4MM]  45.3,7.19 0 top
U$31  [OFF1]  47.97,39.32 0 top
U$32  [#FENCE#3]  50.26,28.14 0 top
U$33  [#INT#0]  50.26,20.52 0 top
U$34  [ROCKER_SWITCH]  52.29,52.27 270 top
U$35  [U#BLOX0]  28.41,10.75 0 top
U$36  [USB1]  30.32,8.08 0 top
U$37  [#3V3#0]  50.26,17.98 0 top
U$38  [#GND#0]  14.57,5.67 90 top
U$39  [#RX2#2]  12.67,5.67 90 top
U$40  [#TX2#1]  10.63,5.67 90 top
U$41  [BLUETOOTH2]  2.76,19.25 0 top
U$42  [ON0]  48.86,64.97 0 top
U$43  [SERIAL20]  7.2,4.27 90 top
U$44  [ROVER3]  10.38,39.45 0 top
U$45  [#RX1#2]  58.39,5.54 90 top
U$46  [#TX1#1]  56.35,5.54 90 top
U$47  [#3V3#0]  54.45,5.54 90 top
U$48  [#GND#0]  60.29,5.54 90 top
U$49  [NMEA1]  61.69,4.14 90 top
U$50  [RADIO0]  15.97,4.52 90 top
U$51  [BROADCAST3]  2.76,17.98 0 top
U$52  [NMEA1]  12.67,22.3 0 top
U$53  [RTCM0]  12.54,13.54 0 top
U$54  [BASE0]  -0.42,56.85 0 top
U$55  [SWITCH1]  3.39,56.85 0 top
U$56  [POWER0]  59.53,57.23 0 top
U$57  [SWITCH1]  63.21,56.21 0 top
U$58  [BLUEOOTH3]  11.4,35.26 0 top
U$59  [CNTR1]  14.7,26.11 0 top
U$60  [RST3]  66.26,47.2 0 bottom
U$61  [EXT0]  11.14,26.11 0 top
U$62  [NMEA2]  6.82,31.95 0 top
U$63  [SERIAL10]  1.49,31.95 0 top
U$64  [CONNECTION1]  2,30.56 0 top

### Tracks (layer width: path | path; a pad name or v marks a point on that pad's centre or on a via)
3.3V  (23 unrouted)
5V  (11 unrouted)
  Top 0.254: U1.4 36.1,98.09 C9.1
!RESET  (1 unrouted)
!SAFE  (1 unrouted)
ANT_VCC  (2 unrouted)
BACKUP  (2 unrouted)
CC1  (1 unrouted)
CC2  (1 unrouted)
CC3  (1 unrouted)
CC4  (1 unrouted)
CHG_LED  (1 unrouted)
D+  (1 unrouted)
D+1  (2 unrouted)
D-  (1 unrouted)
D-1  (2 unrouted)
ESP32_!DTR  (2 unrouted)
ESP32_!RTS  (2 unrouted)
ESP32_EN  (4 unrouted)
ESP32_IO0  (2 unrouted)
ESP32_IO5  (1 unrouted)
ESP32_IO16_RXI2  (1 unrouted)
ESP32_IO17_TXO2  (1 unrouted)
ESP32_IO21_SDA  (1 unrouted)
ESP32_IO22_SCL  (1 unrouted)
ESP32_RXI  (2 unrouted)
ESP32_TXO  (2 unrouted)
EXTERNAL_SERIAL1_RXI  (1 unrouted)
EXTERNAL_SERIAL1_TXO  (2 unrouted)
FENCE_STAT  (2 unrouted)
GND  (111 unrouted)
  pour Top (isolate 0.203, rank 4): 9.11,95.83 59.91,95.83 59.91,63.7 9.11,63.7
  pour Bottom (isolate 0.203, rank 4): 24.8,65.8 44.67,65.8 44.67,40.84 24.8,40.84
  pour Route2 (isolate 0.203): 50.15,0.2 44.25,0.2 44.25,45.52 50.15,45.52
  pour Route15 (isolate 0.203): 48.88,0.2 44.25,0.2 44.25,45.23 48.88,45.23
GPS_ANT1  (2 unrouted)
N$1  (1 unrouted)
N$2  (1 unrouted)
N$5
  Top 0.254: U1.5 38.45,100.95 R7.2
N$6  (1 unrouted)
N$7  (1 unrouted)
N$8  (1 unrouted)
N$10  (1 unrouted)
N$11  (1 unrouted)
N$12  (1 unrouted)
N$13  (1 unrouted)
N$14  (1 unrouted)
N$16  (1 unrouted)
N$18  (1 unrouted)
N$19  (1 unrouted)
N$20  (1 unrouted)
N$22  (1 unrouted)
N$23  (1 unrouted)
N$24  (1 unrouted)
N$25  (1 unrouted)
N$26  (1 unrouted)
N$27  (1 unrouted)
N$28  (1 unrouted)
N$29  (1 unrouted)
N$30  (1 unrouted)
N$31  (1 unrouted)
N$32  (3 unrouted)
NMEA-RX  (1 unrouted)
NMEA-TX  (2 unrouted)
PPS  (1 unrouted)
PPS_STAT  (2 unrouted)
RTK_STAT  (2 unrouted)
RXLV  (1 unrouted)
SCL  (1 unrouted)
SCL_LV  (1 unrouted)
SCL_PU1  (1 unrouted)
SDA  (1 unrouted)
SDA_LV  (1 unrouted)
SDA_PU1  (1 unrouted)
SHLD  (3 unrouted)
TX2_P  (1 unrouted)
TX_READY  (1 unrouted)
TXLV  (1 unrouted)
UNP_D+  (2 unrouted)
UNP_D-  (2 unrouted)
V_BATT  (1 unrouted)
  Top 0.254: J8.2 32.97,102.8 J10.1 36.07,103.08 U1.3 36.2,103.2 C8.1
VBATT_SWTICHED  (1 unrouted)
ZED-RXI1  (1 unrouted)
ZED-RXI2  (1 unrouted)
ZED-TXO1  (1 unrouted)
ZED-TXO2  (1 unrouted)

### Text on the board
Top: v10
Dimension: Route / Out | Route / Out
tPlace: + | -
Measures: Measurements in inches
tDocu: Board thickness is 1.6mm | 4 Layer Board | No clean process | Top PCB surface to inside lid: 11.9mm | Top PCB surface to inside lid: 11.9mm | Inside height: 18.5mm | LED Height: 0.8mm | 12x12mm switch height: 8.5mm | Rocker height: 16.7mm | Recommended air gap: 0.5-1.27mm | Gap to base switch: 3.4mm | Top Cover thickness: 2.25mm | Pipe length: 9.83-10.6mm | 9.5mm / 0.375" is common | LFB037CTP-ND | 492-1341-ND